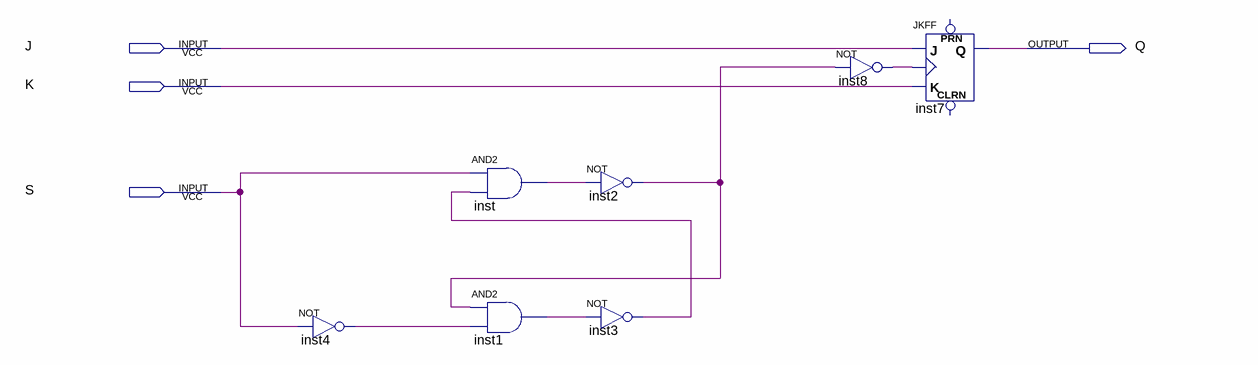
[diagram p0: schematic sheet]
// Quartus schematic Block1.bdf as structural Verilog: 7 symbols, 4 pins
module Block1 (
  input  J,
  input  K,
  input  S,
  output Q
);

  wire inst1_out, inst2_out, inst3_out, inst4_out, inst8_out, inst_out;

  not inst4 (inst4_out, S);
  and inst (inst_out, S, inst3_out);
  and inst1 (inst1_out, inst2_out, inst4_out);
  not inst2 (inst2_out, inst_out);
  not inst3 (inst3_out, inst1_out);
  not inst8 (inst8_out, inst2_out);
  JKFF inst7 (.K(K), .J(J), .CLK(inst8_out), .Q(Q));  // open: PRN, CLRN
endmodule
